# Altium schematic sheet SuperFin_to_Baseboard Signal Template.SchDoc
size C; PageSetup: Record=PageOptions|CenterHorizontal=True|CenterVertical=True|PrintScale=0.70|XCorrection=1.00|YCorrection=1.00|PrintKind=0|BorderSize=5000000|LeftOffset=0|BottomOffset=0|Orientation=2|PaperLength=1000|PaperWidth=1000|Scale=100|PaperSource=7|PrintQuality=-4|MediaType=1|DitherType=10|PaperKind=Tabloid 11 x 17in|PrintScaleMode=1
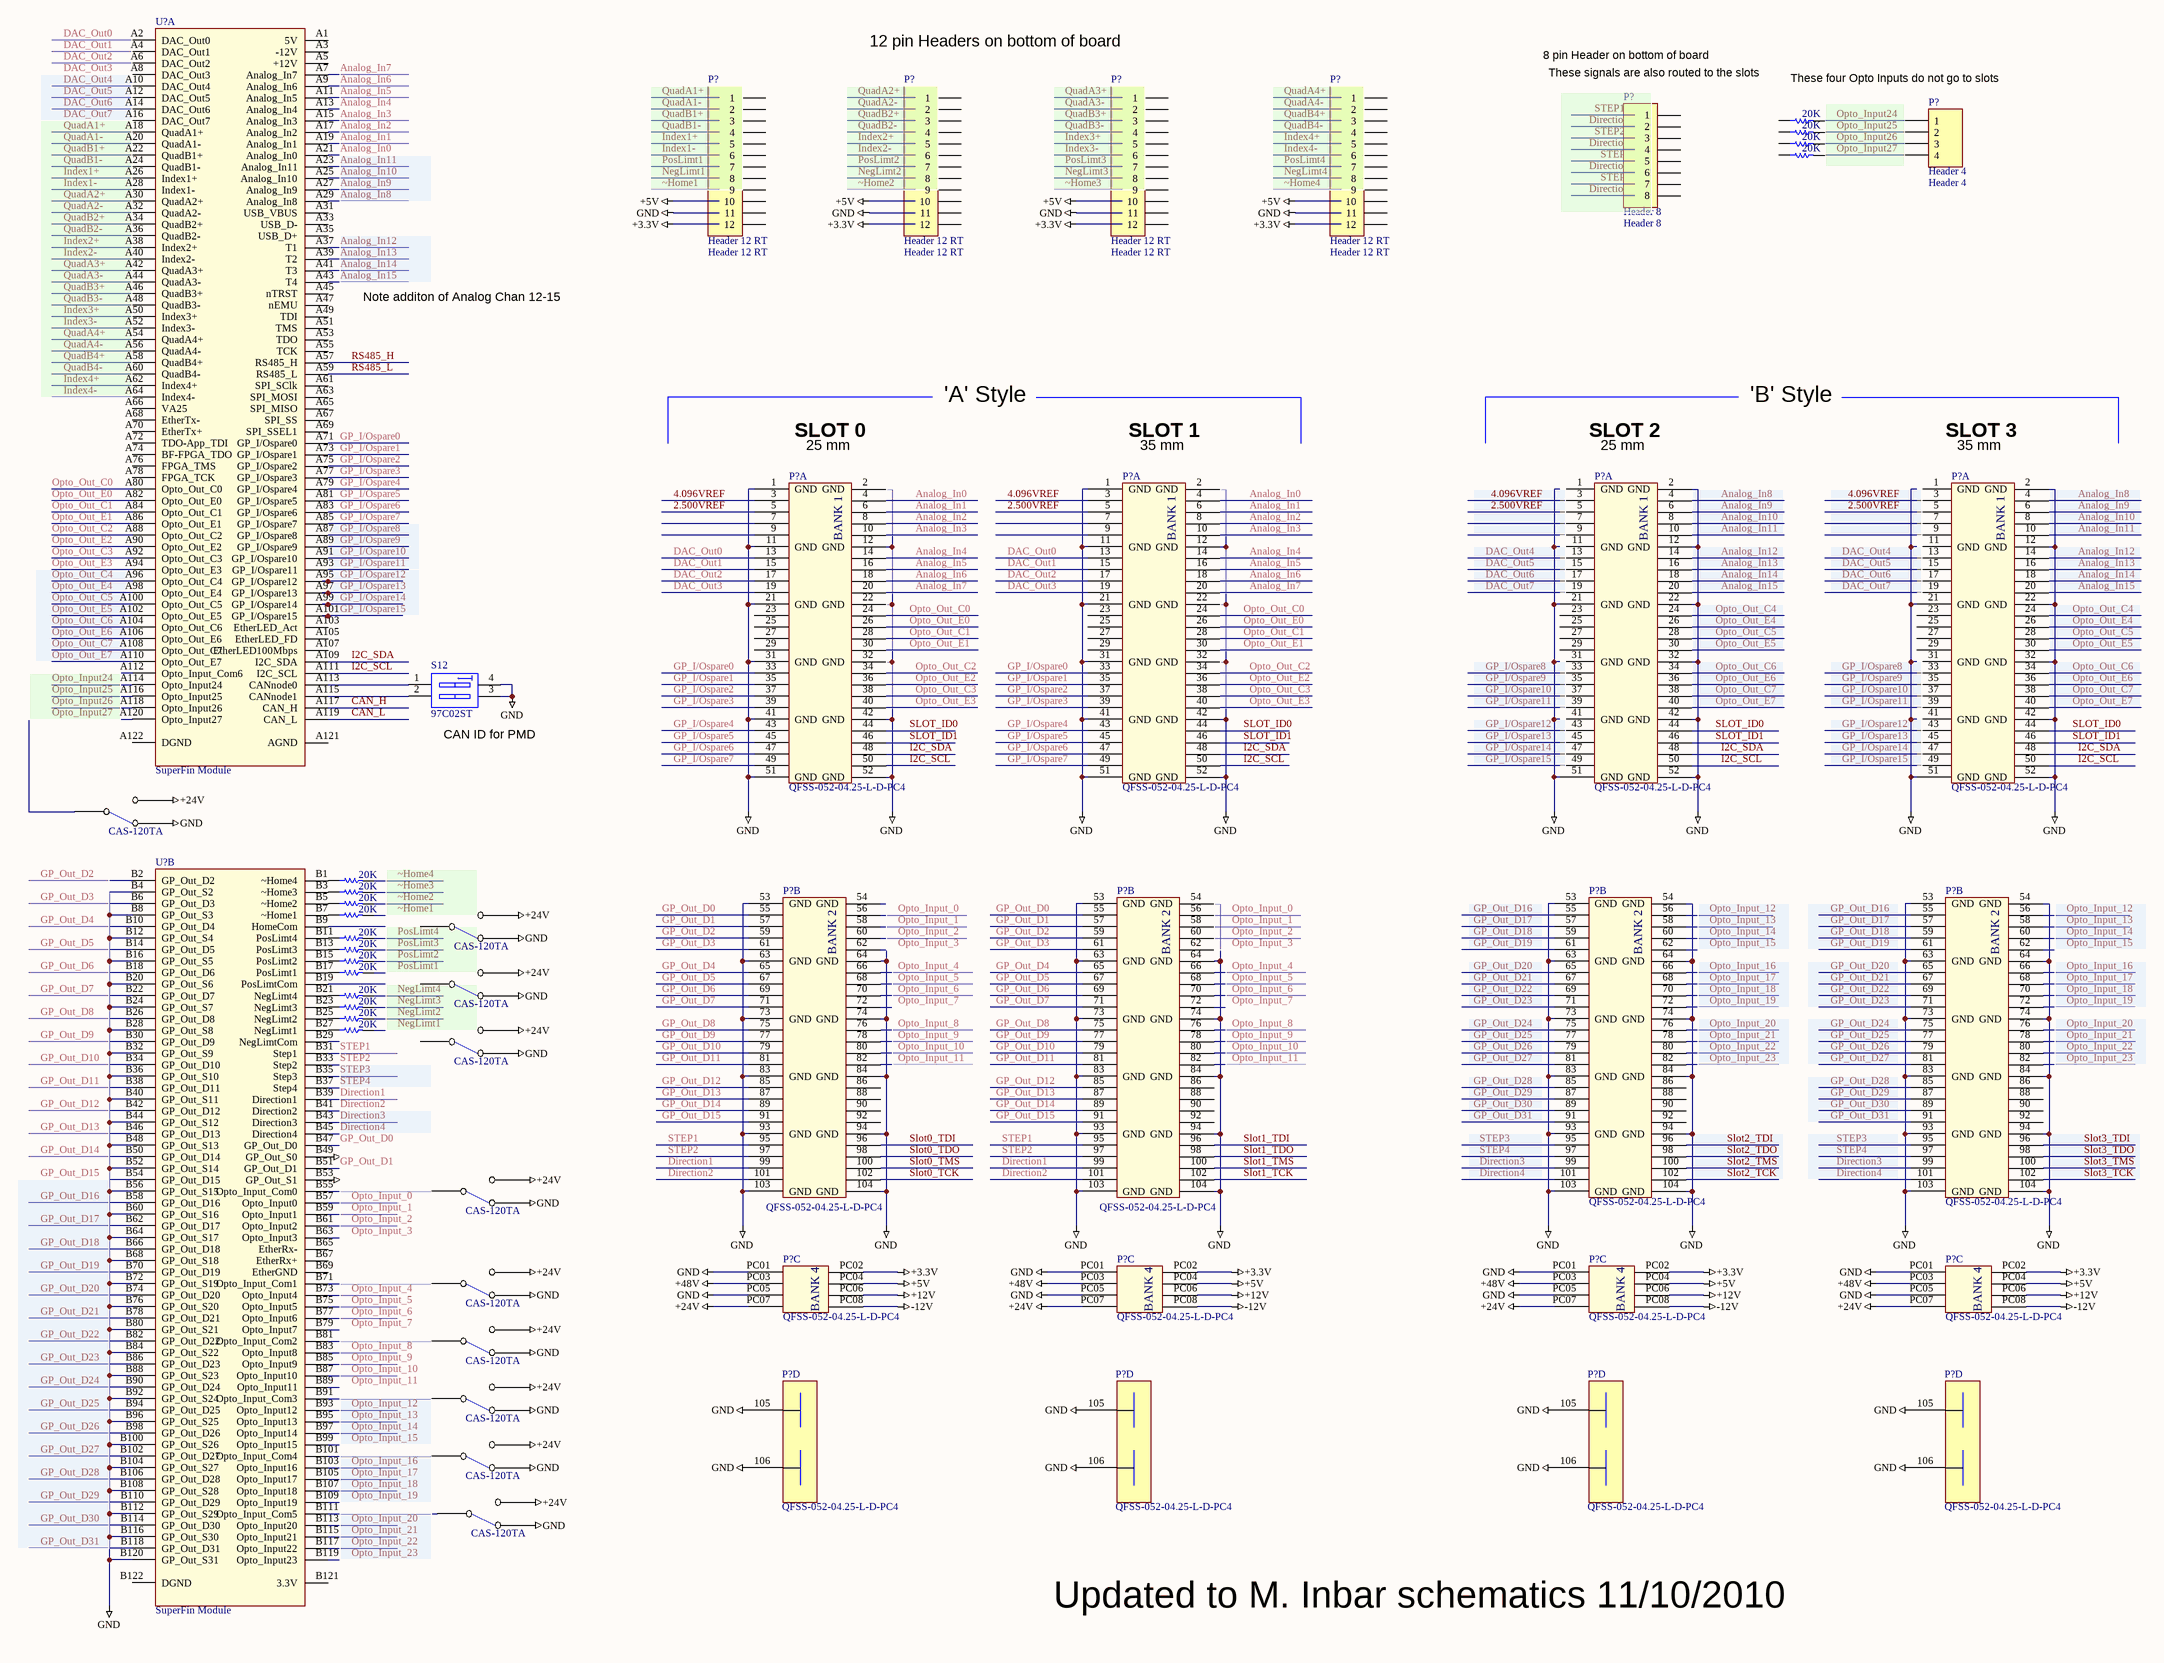
[diagram p0: SuperFin_to_Baseboard Signal Template.SchDoc]

## Parts
(Parts that share a designator on the sheet are numbered #1, #2 ... from top to bottom, then left to right.)
P?#1  Header 12 RT  [HDR 1x12 RT for IDC]
P?#2  Header 12 RT  [HDR 1x12 RT for IDC]
P?#3  Header 12 RT  [HDR 1x12 RT for IDC]
P?#4  Header 12 RT  [HDR 1x12 RT for IDC]
P?#5  Header 8  [HDR1X8 for IDC]
P?#6  Header 4  [HDR1X4 for IDC]
P?#7  value QFSS-052-04.25-L-D-PC4  [QFS SMD PWR PINS - 104 pins]  (hidden comment: QFSS-PC4-104pin)  (part A of 4)
P?#8  value QFSS-052-04.25-L-D-PC4  [QFS SMD PWR PINS - 104 pins]  (hidden comment: QFSS-PC4-104pin)  (part A of 4)
P?#9  value QFSS-052-04.25-L-D-PC4  [QFS SMD PWR PINS - 104 pins]  (hidden comment: QFSS-PC4-104pin)  (part A of 4)
P?#10  value QFSS-052-04.25-L-D-PC4  [QFS SMD PWR PINS - 104 pins]  (hidden comment: QFSS-PC4-104pin)  (part A of 4)
P?#11  value QFSS-052-04.25-L-D-PC4  [QFS SMD PWR PINS - 104 pins]  (hidden comment: QFSS-PC4-104pin)  (part B of 4)
P?#12  value QFSS-052-04.25-L-D-PC4  [QFS SMD PWR PINS - 104 pins]  (hidden comment: QFSS-PC4-104pin)  (part B of 4)
P?#13  value QFSS-052-04.25-L-D-PC4  [QFS SMD PWR PINS - 104 pins]  (hidden comment: QFSS-PC4-104pin)  (part B of 4)
P?#14  value QFSS-052-04.25-L-D-PC4  [QFS SMD PWR PINS - 104 pins]  (hidden comment: QFSS-PC4-104pin)  (part B of 4)
P?#15  value QFSS-052-04.25-L-D-PC4  [QFS SMD PWR PINS - 104 pins]  (hidden comment: QFSS-PC4-104pin)  (part C of 4)
P?#16  value QFSS-052-04.25-L-D-PC4  [QFS SMD PWR PINS - 104 pins]  (hidden comment: QFSS-PC4-104pin)  (part C of 4)
P?#17  value QFSS-052-04.25-L-D-PC4  [QFS SMD PWR PINS - 104 pins]  (hidden comment: QFSS-PC4-104pin)  (part C of 4)
P?#18  value QFSS-052-04.25-L-D-PC4  [QFS SMD PWR PINS - 104 pins]  (hidden comment: QFSS-PC4-104pin)  (part C of 4)
P?#19  value QFSS-052-04.25-L-D-PC4  [QFS SMD PWR PINS - 104 pins]  (hidden comment: QFSS-PC4-104pin)  (part D of 4)
P?#20  value QFSS-052-04.25-L-D-PC4  [QFS SMD PWR PINS - 104 pins]  (hidden comment: QFSS-PC4-104pin)  (part D of 4)
P?#21  value QFSS-052-04.25-L-D-PC4  [QFS SMD PWR PINS - 104 pins]  (hidden comment: QFSS-PC4-104pin)  (part D of 4)
P?#22  value QFSS-052-04.25-L-D-PC4  [QFS SMD PWR PINS - 104 pins]  (hidden comment: QFSS-PC4-104pin)  (part D of 4)
R?#1  value 20K  [SMD_0805]  (hidden comment: Res 0805)
R?#2  value 20K  [SMD_0805]  (hidden comment: Res 0805)
R?#3  value 20K  [SMD_0805]  (hidden comment: Res 0805)
R?#4  value 20K  [SMD_0805]  (hidden comment: Res 0805)
R?#5  value 20K  [AXIAL-0.4]  (hidden comment: Res TH)
R?#6  value 20K  [AXIAL-0.4]  (hidden comment: Res TH)
R?#7  value 20K  [AXIAL-0.4]  (hidden comment: Res TH)
R?#8  value 20K  [AXIAL-0.4]  (hidden comment: Res TH)
R?#9  value 20K  [AXIAL-0.4]  (hidden comment: Res TH)
R?#10  value 20K  [AXIAL-0.4]  (hidden comment: Res TH)
R?#11  value 20K  [AXIAL-0.4]  (hidden comment: Res TH)
R?#12  value 20K  [AXIAL-0.4]  (hidden comment: Res TH)
R?#13  value 20K  [AXIAL-0.4]  (hidden comment: Res TH)
R?#14  value 20K  [AXIAL-0.4]  (hidden comment: Res TH)
R?#15  value 20K  [AXIAL-0.4]  (hidden comment: Res TH)
R?#16  value 20K  [AXIAL-0.4]  (hidden comment: Res TH)
S12  97C02ST  [97C02ST]
S?#1  CAS-120TA  [CAS-120B]
S?#2  CAS-120TA  [CAS-120B]
S?#3  CAS-120TA  [CAS-120B]
S?#4  CAS-120TA  [CAS-120B]
S?#5  CAS-120TA  [CAS-120B]
S?#6  CAS-120TA  [CAS-120B]
S?#7  CAS-120TA  [CAS-120B]
S?#8  CAS-120TA  [CAS-120B]
S?#9  CAS-120TA  [CAS-120B]
S?#10  CAS-120TA  [CAS-120B]
U?#1  SuperFin Module  [SuperFin Footprint]  (part A of 2)
U?#2  SuperFin Module  [SuperFin Footprint]  (part B of 2)

## Nets
+3.3V: P?#15.PC02 P?#16.PC02 P?#17.PC02 P?#18.PC02
+5V: P?#15.PC04 P?#16.PC04 P?#17.PC04 P?#18.PC04
+12V: P?#15.PC06 P?#16.PC06 P?#17.PC06 P?#18.PC06
+24V: P?#15.PC07 P?#16.PC07 P?#17.PC07 P?#18.PC07 S?#1.1(NO) S?#2.1(NO) S?#3.1(NO) S?#4.1(NO) S?#5.1(NO) S?#6.1(NO) S?#7.1(NO) S?#8.1(NO) S?#9.1(NO) S?#10.1(NO)
+48V: P?#15.PC03 P?#16.PC03 P?#17.PC03 P?#18.PC03
-12V: P?#15.PC08 P?#16.PC08 P?#17.PC08 P?#18.PC08
GND: P?#7.1(GND) P?#7.2(GND) P?#7.11(GND) P?#7.12(GND) P?#7.21(GND) P?#7.22(GND) P?#7.31(GND) P?#7.32(GND) P?#7.41(GND) P?#7.42(GND) P?#7.51(GND) P?#7.52(GND) P?#8.1(GND) P?#8.2(GND) P?#8.11(GND) P?#8.12(GND) P?#8.21(GND) P?#8.22(GND) P?#8.31(GND) P?#8.32(GND) P?#8.41(GND) P?#8.42(GND) P?#8.51(GND) P?#8.52(GND) P?#9.1(GND) P?#9.2(GND) P?#9.11(GND) P?#9.12(GND) P?#9.21(GND) P?#9.22(GND) P?#9.31(GND) P?#9.32(GND) P?#9.41(GND) P?#9.42(GND) P?#9.51(GND) P?#9.52(GND) P?#10.1(GND) P?#10.2(GND) P?#10.11(GND) P?#10.12(GND) P?#10.21(GND) P?#10.22(GND) P?#10.31(GND) P?#10.32(GND) P?#10.41(GND) P?#10.42(GND) P?#10.51(GND) P?#10.52(GND) P?#11.53(GND) P?#11.54(GND) P?#11.63(GND) P?#11.64(GND) P?#11.73(GND) P?#11.74(GND) P?#11.83(GND) P?#11.84(GND) P?#11.93(GND) P?#11.94(GND) P?#11.103(GND) P?#11.104(GND) P?#12.53(GND) P?#12.54(GND) P?#12.63(GND) P?#12.64(GND) P?#12.73(GND) P?#12.74(GND) P?#12.83(GND) P?#12.84(GND) P?#12.93(GND) P?#12.94(GND) P?#12.103(GND) P?#12.104(GND) P?#13.53(GND) P?#13.54(GND) P?#13.63(GND) P?#13.64(GND) P?#13.73(GND) P?#13.74(GND) P?#13.83(GND) P?#13.84(GND) P?#13.93(GND) P?#13.94(GND) P?#13.103(GND) P?#13.104(GND) P?#14.53(GND) P?#14.54(GND) P?#14.63(GND) P?#14.64(GND) P?#14.73(GND) P?#14.74(GND) P?#14.83(GND) P?#14.84(GND) P?#14.93(GND) P?#14.94(GND) P?#14.103(GND) P?#14.104(GND) P?#15.PC01 P?#15.PC05 P?#16.PC01 P?#16.PC05 P?#17.PC01 P?#17.PC05 P?#18.PC01 P?#18.PC05 P?#19.105(GND) P?#19.106(GND) P?#20.105(GND) P?#20.106(GND) P?#21.105(GND) P?#21.106(GND) P?#22.105(GND) P?#22.106(GND) S12.3(B2) S12.4(B1) S?#1.3(NC) S?#2.3(NC) S?#3.3(NC) S?#4.3(NC) S?#5.3(NC) S?#6.3(NC) S?#7.3(NC) S?#8.3(NC) S?#9.3(NC) S?#10.3(NC) U?#2.B4(GP_Out_S2) U?#2.B8(GP_Out_S3) U?#2.B12(GP_Out_S4) U?#2.B16(GP_Out_S5) U?#2.B20(GP_Out_S6) U?#2.B24(GP_Out_S7) U?#2.B28(GP_Out_S8) U?#2.B32(GP_Out_S9) U?#2.B36(GP_Out_S10) U?#2.B40(GP_Out_S11) U?#2.B44(GP_Out_S12) U?#2.B48(GP_Out_S13) U?#2.B49(GP_Out_S0) U?#2.B52(GP_Out_S14) U?#2.B53(GP_Out_S1) U?#2.B56(GP_Out_S15) U?#2.B60(GP_Out_S16) U?#2.B64(GP_Out_S17) U?#2.B68(GP_Out_S18) U?#2.B72(GP_Out_S19) U?#2.B76(GP_Out_S20) U?#2.B80(GP_Out_S21) U?#2.B84(GP_Out_S22) U?#2.B88(GP_Out_S23) U?#2.B92(GP_Out_S24) U?#2.B96(GP_Out_S25) U?#2.B100(GP_Out_S26) U?#2.B104(GP_Out_S27) U?#2.B108(GP_Out_S28) U?#2.B112(GP_Out_S29) U?#2.B116(GP_Out_S30) U?#2.B120(GP_Out_S31)
2.500VREF: P?#7.5 P?#8.5 P?#9.5 P?#10.5
4.096VREF: P?#7.3 P?#8.3 P?#9.3 P?#10.3
Analog_In0: P?#7.4 P?#8.4 U?#1.A21(Analog_In0)
Analog_In1: P?#7.6 P?#8.6 U?#1.A19(Analog_In1)
Analog_In2: P?#7.8 P?#8.8 U?#1.A17(Analog_In2)
Analog_In3: P?#7.10 P?#8.10 U?#1.A15(Analog_In3)
Analog_In4: P?#7.14 P?#8.14 U?#1.A13(Analog_In4)
Analog_In5: P?#7.16 P?#8.16 U?#1.A11(Analog_In5)
Analog_In6: P?#7.18 P?#8.18 U?#1.A9(Analog_In6)
Analog_In7: P?#7.20 P?#8.20 U?#1.A7(Analog_In7)
Analog_In8: P?#9.4 P?#10.4 U?#1.A29(Analog_In8)
Analog_In9: P?#9.6 P?#10.6 U?#1.A27(Analog_In9)
Analog_In10: P?#9.8 P?#10.8 U?#1.A25(Analog_In10)
Analog_In11: P?#9.10 P?#10.10 U?#1.A23(Analog_In11)
Analog_In12: P?#9.14 P?#10.14 U?#1.A37(T1)
Analog_In13: P?#9.16 P?#10.16 U?#1.A39(T2)
Analog_In14: P?#9.18 P?#10.18 U?#1.A41(T3)
Analog_In15: P?#9.20 P?#10.20 U?#1.A43(T4)
CAN_H: U?#1.A117(CAN_H)
CAN_L: U?#1.A119(CAN_L)
DAC_Out0: P?#7.13 P?#8.13 U?#1.A2(DAC_Out0)
DAC_Out1: P?#7.15 P?#8.15 U?#1.A4(DAC_Out1)
DAC_Out2: P?#7.17 P?#8.17 U?#1.A6(DAC_Out2)
DAC_Out3: P?#7.19 P?#8.19 U?#1.A8(DAC_Out3)
DAC_Out4: P?#9.13 P?#10.13 U?#1.A10(DAC_Out4)
DAC_Out5: P?#9.15 P?#10.15 U?#1.A12(DAC_Out5)
DAC_Out6: P?#9.17 P?#10.17 U?#1.A14(DAC_Out6)
DAC_Out7: P?#9.19 P?#10.19 U?#1.A16(DAC_Out7)
Direction1: P?#11.99 P?#12.99 U?#2.B39(Direction1)
Direction2: P?#11.101 P?#12.101 U?#2.B41(Direction2)
Direction3: P?#13.99 P?#14.99 U?#2.B43(Direction3)
Direction4: P?#13.101 P?#14.101 U?#2.B45(Direction4)
GP_I/Ospare0: P?#7.33 P?#8.33 U?#1.A71(GP_I/Ospare0)
GP_I/Ospare1: P?#7.35 P?#8.35 U?#1.A73(GP_I/Ospare1)
GP_I/Ospare2: P?#7.37 P?#8.37 U?#1.A75(GP_I/Ospare2)
GP_I/Ospare3: P?#7.39 P?#8.39 U?#1.A77(GP_I/Ospare3)
GP_I/Ospare4: P?#7.43 P?#8.43 U?#1.A79(GP_I/Ospare4)
GP_I/Ospare5: P?#7.45 P?#8.45 U?#1.A81(GP_I/Ospare5)
GP_I/Ospare6: P?#7.47 P?#8.47 U?#1.A83(GP_I/Ospare6)
GP_I/Ospare7: P?#7.49 P?#8.49 U?#1.A85(GP_I/Ospare7)
GP_I/Ospare8: P?#9.33 P?#10.33 U?#1.A87(GP_I/Ospare8)
GP_I/Ospare9: P?#9.35 P?#10.35 U?#1.A89(GP_I/Ospare9)
GP_I/Ospare10: P?#9.37 P?#10.37 U?#1.A91(GP_I/Ospare10)
GP_I/Ospare11: P?#9.39 P?#10.39 U?#1.A93(GP_I/Ospare11)
GP_I/Ospare12: P?#9.43 P?#10.43 U?#1.A95(GP_I/Ospare12)
GP_I/Ospare13: P?#9.45 P?#10.45 U?#1.A97(GP_I/Ospare13)
GP_I/Ospare14: P?#9.47 P?#10.47 U?#1.A99(GP_I/Ospare14)
GP_I/Ospare15: P?#9.49 P?#10.49 U?#1.A101(GP_I/Ospare15)
GP_Out_D0: P?#11.55 P?#12.55 U?#2.B47(GP_Out_D0)
GP_Out_D1: P?#11.57 P?#12.57 U?#2.B51(GP_Out_D1)
GP_Out_D2: P?#11.59 P?#12.59 U?#2.B2(GP_Out_D2)
GP_Out_D3: P?#11.61 P?#12.61 U?#2.B6(GP_Out_D3)
GP_Out_D4: P?#11.65 P?#12.65 U?#2.B10(GP_Out_D4)
GP_Out_D5: P?#11.67 P?#12.67 U?#2.B14(GP_Out_D5)
GP_Out_D6: P?#11.69 P?#12.69 U?#2.B18(GP_Out_D6)
GP_Out_D7: P?#11.71 P?#12.71 U?#2.B22(GP_Out_D7)
GP_Out_D8: P?#11.75 P?#12.75 U?#2.B26(GP_Out_D8)
GP_Out_D9: P?#11.77 P?#12.77 U?#2.B30(GP_Out_D9)
GP_Out_D10: P?#11.79 P?#12.79 U?#2.B34(GP_Out_D10)
GP_Out_D11: P?#11.81 P?#12.81 U?#2.B38(GP_Out_D11)
GP_Out_D12: P?#11.85 P?#12.85 U?#2.B42(GP_Out_D12)
GP_Out_D13: P?#11.87 P?#12.87 U?#2.B46(GP_Out_D13)
GP_Out_D14: P?#11.89 P?#12.89 U?#2.B50(GP_Out_D14)
GP_Out_D15: P?#11.91 P?#12.91 U?#2.B54(GP_Out_D15)
GP_Out_D16: P?#13.55 P?#14.55 U?#2.B58(GP_Out_D16)
GP_Out_D17: P?#13.57 P?#14.57 U?#2.B62(GP_Out_D17)
GP_Out_D18: P?#13.59 P?#14.59 U?#2.B66(GP_Out_D18)
GP_Out_D19: P?#13.61 P?#14.61 U?#2.B70(GP_Out_D19)
GP_Out_D20: P?#13.65 P?#14.65 U?#2.B74(GP_Out_D20)
GP_Out_D21: P?#13.67 P?#14.67 U?#2.B78(GP_Out_D21)
GP_Out_D22: P?#13.69 P?#14.69 U?#2.B82(GP_Out_D22)
GP_Out_D23: P?#13.71 P?#14.71 U?#2.B86(GP_Out_D23)
GP_Out_D24: P?#13.75 P?#14.75 U?#2.B90(GP_Out_D24)
GP_Out_D25: P?#13.77 P?#14.77 U?#2.B94(GP_Out_D25)
GP_Out_D26: P?#13.79 P?#14.79 U?#2.B98(GP_Out_D26)
GP_Out_D27: P?#13.81 P?#14.81 U?#2.B102(GP_Out_D27)
GP_Out_D28: P?#13.85 P?#14.85 U?#2.B106(GP_Out_D28)
GP_Out_D29: P?#13.87 P?#14.87 U?#2.B110(GP_Out_D29)
GP_Out_D30: P?#13.89 P?#14.89 U?#2.B114(GP_Out_D30)
GP_Out_D31: P?#13.91 P?#14.91 U?#2.B118(GP_Out_D31)
I2C_SCL: P?#7.50 P?#8.50 P?#9.50 P?#10.50 U?#1.A111(I2C_SCL)
I2C_SDA: P?#7.48 P?#8.48 P?#9.48 P?#10.48 U?#1.A109(I2C_SDA)
Index1+: U?#1.A26(Index1+)
Index1-: U?#1.A28(Index1-)
Index2+: U?#1.A38(Index2+)
Index2-: U?#1.A40(Index2-)
Index3+: U?#1.A50(Index3+)
Index3-: U?#1.A52(Index3-)
Index4+: U?#1.A62(Index4+)
Index4-: U?#1.A64(Index4-)
NegLimt1: R?#16.2
NegLimt2: R?#15.2
NegLimt3: R?#14.2
NegLimt4: R?#13.2
Opto_Input24: P?#6.1 R?#1.2 U?#1.A114(Opto_Input24)
Opto_Input25: P?#6.2 R?#2.2 U?#1.A116(Opto_Input25)
Opto_Input26: P?#6.3 R?#3.2 U?#1.A118(Opto_Input26)
Opto_Input27: P?#6.4 R?#4.2 U?#1.A120(Opto_Input27)
Opto_Input_0: P?#11.56 P?#12.56 U?#2.B57(Opto_Input0)
Opto_Input_1: P?#11.58 P?#12.58 U?#2.B59(Opto_Input1)
Opto_Input_2: P?#11.60 P?#12.60 U?#2.B61(Opto_Input2)
Opto_Input_3: P?#11.62 P?#12.62 U?#2.B63(Opto_Input3)
Opto_Input_4: P?#11.66 P?#12.66 U?#2.B73(Opto_Input4)
Opto_Input_5: P?#11.68 P?#12.68 U?#2.B75(Opto_Input5)
Opto_Input_6: P?#11.70 P?#12.70 U?#2.B77(Opto_Input6)
Opto_Input_7: P?#11.72 P?#12.72 U?#2.B79(Opto_Input7)
Opto_Input_8: P?#11.76 P?#12.76 U?#2.B83(Opto_Input8)
Opto_Input_9: P?#11.78 P?#12.78 U?#2.B85(Opto_Input9)
Opto_Input_10: P?#11.80 P?#12.80 U?#2.B87(Opto_Input10)
Opto_Input_11: P?#11.82 P?#12.82 U?#2.B89(Opto_Input11)
Opto_Input_12: P?#13.56 P?#14.56 U?#2.B93(Opto_Input12)
Opto_Input_13: P?#13.58 P?#14.58 U?#2.B95(Opto_Input13)
Opto_Input_14: P?#13.60 P?#14.60 U?#2.B97(Opto_Input14)
Opto_Input_15: P?#13.62 P?#14.62 U?#2.B99(Opto_Input15)
Opto_Input_16: P?#13.66 P?#14.66 U?#2.B103(Opto_Input16)
Opto_Input_17: P?#13.68 P?#14.68 U?#2.B105(Opto_Input17)
Opto_Input_18: P?#13.70 P?#14.70 U?#2.B107(Opto_Input18)
Opto_Input_19: P?#13.72 P?#14.72 U?#2.B109(Opto_Input19)
Opto_Input_20: P?#13.76 P?#14.76 U?#2.B113(Opto_Input20)
Opto_Input_21: P?#13.78 P?#14.78 U?#2.B115(Opto_Input21)
Opto_Input_22: P?#13.80 P?#14.80 U?#2.B117(Opto_Input22)
Opto_Input_23: P?#13.82 P?#14.82 U?#2.B119(Opto_Input23)
Opto_Out_C0: P?#7.24 P?#8.24 U?#1.A80(Opto_Out_C0)
Opto_Out_C1: P?#7.28 P?#8.28 U?#1.A84(Opto_Out_C1)
Opto_Out_C2: P?#7.34 P?#8.34 U?#1.A88(Opto_Out_C2)
Opto_Out_C3: P?#7.38 P?#8.38 U?#1.A92(Opto_Out_C3)
Opto_Out_C4: P?#9.24 P?#10.24 U?#1.A96(Opto_Out_C4)
Opto_Out_C5: P?#9.28 P?#10.28 U?#1.A100(Opto_Out_C5)
Opto_Out_C6: P?#9.34 P?#10.34 U?#1.A104(Opto_Out_C6)
Opto_Out_C7: P?#9.38 P?#10.38 U?#1.A108(Opto_Out_C7)
Opto_Out_E0: P?#7.26 P?#8.26 U?#1.A82(Opto_Out_E0)
Opto_Out_E1: P?#7.30 P?#8.30 U?#1.A86(Opto_Out_E1)
Opto_Out_E2: P?#7.36 P?#8.36 U?#1.A90(Opto_Out_E2)
Opto_Out_E3: P?#7.40 P?#8.40 U?#1.A94(Opto_Out_E3)
Opto_Out_E4: P?#9.26 P?#10.26 U?#1.A98(Opto_Out_E4)
Opto_Out_E5: P?#9.30 P?#10.30 U?#1.A102(Opto_Out_E5)
Opto_Out_E6: P?#9.36 P?#10.36 U?#1.A106(Opto_Out_E6)
Opto_Out_E7: P?#9.40 P?#10.40 U?#1.A110(Opto_Out_E7)
PosLimt1: R?#12.2
PosLimt2: R?#11.2
PosLimt3: R?#10.2
PosLimt4: R?#9.2
QuadA1+: U?#1.A18(QuadA1+)
QuadA1-: U?#1.A20(QuadA1-)
QuadA2+: U?#1.A30(QuadA2+)
QuadA2-: U?#1.A32(QuadA2-)
QuadA3+: U?#1.A42(QuadA3+)
QuadA3-: U?#1.A44(QuadA3-)
QuadA4+: U?#1.A54(QuadA4+)
QuadA4-: U?#1.A56(QuadA4-)
QuadB1+: U?#1.A22(QuadB1+)
QuadB1-: U?#1.A24(QuadB1-)
QuadB2+: U?#1.A34(QuadB2+)
QuadB2-: U?#1.A36(QuadB2-)
QuadB3+: U?#1.A46(QuadB3+)
QuadB3-: U?#1.A48(QuadB3-)
QuadB4+: U?#1.A58(QuadB4+)
QuadB4-: U?#1.A60(QuadB4-)
RS485_H: U?#1.A57(RS485_H)
RS485_L: U?#1.A59(RS485_L)
Slot0_TCK: P?#11.102
Slot0_TDI: P?#11.96
Slot0_TDO: P?#11.98
Slot0_TMS: P?#11.100
Slot1_TCK: P?#12.102
Slot1_TDI: P?#12.96
Slot1_TDO: P?#12.98
Slot1_TMS: P?#12.100
Slot2_TCK: P?#13.102
Slot2_TDI: P?#13.96
Slot2_TDO: P?#13.98
Slot2_TMS: P?#13.100
Slot3_TCK: P?#14.102
Slot3_TDI: P?#14.96
Slot3_TDO: P?#14.98
Slot3_TMS: P?#14.100
SLOT_ID0: P?#7.44 P?#8.44 P?#9.44 P?#10.44
SLOT_ID1: P?#7.46 P?#8.46 P?#9.46 P?#10.46
STEP1: P?#11.95 P?#12.95 U?#2.B31(Step1)
STEP2: P?#11.97 P?#12.97 U?#2.B33(Step2)
STEP3: P?#13.95 P?#14.95 U?#2.B35(Step3)
STEP4: P?#13.97 P?#14.97 U?#2.B37(Step4)
~Home1: R?#8.2
~Home2: R?#7.2
~Home3: R?#6.2
~Home4: R?#5.2
NetR?#5_1: R?#5.1 U?#2.B1(~Home4)
NetR?#6_1: R?#6.1 U?#2.B3(~Home3)
NetR?#7_1: R?#7.1 U?#2.B5(~Home2)
NetR?#8_1: R?#8.1 U?#2.B7(~Home1)
NetR?#9_1: R?#9.1 U?#2.B11(PosLimt4)
NetR?#10_1: R?#10.1 U?#2.B13(PosLimt3)
NetR?#11_1: R?#11.1 U?#2.B15(PosLimt2)
NetR?#12_1: R?#12.1 U?#2.B17(PosLimt1)
NetR?#13_1: R?#13.1 U?#2.B21(NegLimt4)
NetR?#14_1: R?#14.1 U?#2.B23(NegLimt3)
NetR?#15_1: R?#15.1 U?#2.B25(NegLimt2)
NetR?#16_1: R?#16.1 U?#2.B27(NegLimt1)
NetS12_1: S12.1(A1) U?#1.A113(CANnode0)
NetS12_2: S12.2(A2) U?#1.A115(CANnode1)
NetS?#1_2: S?#1.2(COM) U?#1.A112(Opto_Input_Com6)
NetS?#2_2: S?#2.2(COM) U?#2.B9(HomeCom)
NetS?#3_2: S?#3.2(COM) U?#2.B19(PosLimtCom)
NetS?#4_2: S?#4.2(COM) U?#2.B29(NegLimtCom)
NetS?#5_2: S?#5.2(COM) U?#2.B55(Opto_Input_Com0)
NetS?#6_2: S?#6.2(COM) U?#2.B71(Opto_Input_Com1)
NetS?#7_2: S?#7.2(COM) U?#2.B81(Opto_Input_Com2)
NetS?#8_2: S?#8.2(COM) U?#2.B91(Opto_Input_Com3)
NetS?#9_2: S?#9.2(COM) U?#2.B101(Opto_Input_Com4)
NetS?#10_2: S?#10.2(COM) U?#2.B111(Opto_Input_Com5)

Not connected (* = marked no-connect by the designer): P?#1 1 2 3 4 5 6 7 8 9 10 11 12; P?#2 1 2 3 4 5 6 7 8 9 10 11 12; P?#3 1 2 3 4 5 6 7 8 9 10 11 12; P?#4 1 2 3 4 5 6 7 8 9 10 11 12; P?#5 1 2 3 4 5 6 7 8; P?#7 7 9 23 25 27 29; P?#8 7 9 23 25 27 29; P?#9 7 9 23 25 27 29; P?#10 7 9 23 25 27 29; P?#11 86 88 90 92; P?#12 86 88 90 92; P?#13 86 88 90 92; P?#14 86 88 90 92; R?#1 1; R?#2 1; R?#3 1; R?#4 1; U?#1 A1(5V) A3(-12V) A5(+12V) A31(USB_VBUS) A33(USB_D-) A35(USB_D+) A45(nTRST) A47(nEMU) A49(TDI) A51(TMS) A53(TDO) A55(TCK) A61(SPI_SClk) A63(SPI_MOSI) A65(SPI_MISO) A66(VA25) A67(SPI_SS) A68(EtherTx-) A69(SPI_SSEL1) A70(EtherTx+) A72(TDO-App_TDI) A74(BF-FPGA_TDO) A76(FPGA_TMS) A78(FPGA_TCK) A103(EtherLED_Act) A105(EtherLED_FD) A107(EtherLED100Mbps) A121(AGND) A122(DGND); U?#2 B65(EtherRx-) B67(EtherRx+) B69(EtherGND) B121(3.3V) B122(DGND)

## Notes on the sheet
- 12 pin Headers on bottom of board
- 8 pin Header on bottom of board
- These signals are also routed to the slots
- These four Opto Inputs do not go to slots
- Note additon of Analog Chan 12-15
- 'A' Style
- 'B' Style
- SLOT 0
- (near P?#7) 25 mm
- SLOT 1
- (near P?#8) 35 mm
- SLOT 2
- (near P?#9) 25 mm
- SLOT 3
- (near P?#10) 35 mm
- (near S12) CAN ID for PMD
- Updated to M. Inbar schematics 11/10/2010
- (in symbol QFSS-PC4-104pin, part A) BANK 1
- (in symbol QFSS-PC4-104pin, part B) BANK 2
- (in symbol QFSS-PC4-104pin, part C) BANK 4

## Library data of the parts
P?#1-P?#4 = Header 12 RT: Header, 12-Pin Right Angle; VALUE: Header 12 RT
P?#5 = Header 8: Header, 8-Pin; VALUE: Header 8
P?#6 = Header 4: Header, 4-Pin; LCO p/n: 125-00037; VALUE: Header 4
P?#7-P?#22 = QFSS-PC4-104pin: SAMTEC QFSS W/PWR PINS; Vendor Mult.: 1; Manufacturer: SAMTEC; Manuf p/n: QFSS-052-04.25-L-D-PC4; Vendor: SAMTEC; Vendor p/n: QFSS-052-04.25-L-D-PC4; COST: 17.42
R?#1-R?#4 = Res SMD: Resistor 0805; Manufacturer: Vishay/Dale; Manuf p/n: CRCW080520KFKEA; Vendor: DIGIKEY; Vendor p/n: 541-20KCCT-ND; Vendor Mult.: 10; COST: 0.09
R?#5-R?#16 = Res TH: Resistor
S12 = SW DIP-2: DIP Switch, 2 Position, SPST; Manufacturer: Grayhill; Vendor: DIGIKEY; Vendor Mult.: 1; Vendor p/n: GH1370-ND; LCO p/n: 185-00008; COST: 1.97; Manuf p/n: 97C02ST; Value: SW DIP-2
S?#1-S?#10 = SW_SPDT_DOUG: Manufacturer: Copal Electronics; Vendor: DIGIKEY; Vendor Mult.: 1; Vendor p/n: CAS120JTR-ND; LCO p/n: 185-00010; COST: 1.27; Manuf p/n: CAS-120TA; Value: SW_SPDT
U?#1 U?#2 = SuperFin Module: LCO p/n: 830-00010